# Altium schematic sheet LED.SchDoc
size A4; SheetNumber: 1; SheetTotal: 1
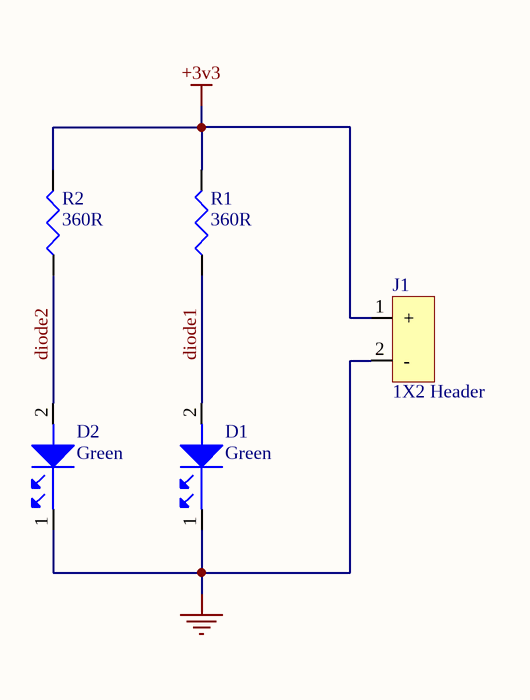
[diagram p0: LED.SchDoc]

## Parts
D1  Green  [LED0603G]
D2  Green  [LED0603G]
J1  1X2 Header  [Header1X2]
R1  360R  [R0805]
R2  360R  [R0805]

## Nets
+3v3: J1.1(+) R1.2 R2.2
GND: D1.1 D2.1 J1.2(-)
diode1: D1.2 R1.1
diode2: D2.2 R2.1

## Library data of the parts
D1 D2 = LNJ337W83RA: Manufacturer: Panasonic; Name: Green 0603 LED; Part No: LNJ337W83RA
J1 = 22232021: Manufacturer: Molex; Name: Header 1X2; Series No: 6373; Part No: 22232021
R1 R2 = CRCW-HP e3: Manufacturer: Vishay; name: resistor; Part No: CRCW-HP e3